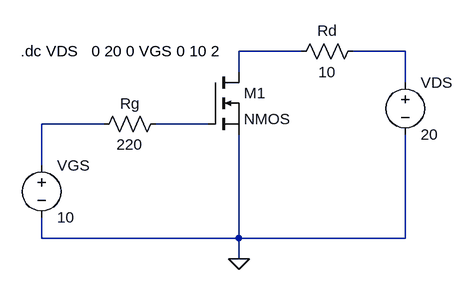
[diagram p0: schematic MOSFET (1).asc]
MOSFET (1).asc, the LTspice schematic file:
Version 4
SHEET 1 880 680
WIRE 368 -16 272 -16
WIRE 528 -16 448 -16
WIRE 272 16 272 -16
WIRE 528 32 528 -16
WIRE 64 96 -32 96
WIRE 224 96 144 96
WIRE -32 160 -32 96
WIRE -32 272 -32 240
WIRE 272 272 272 112
WIRE 272 272 -32 272
WIRE 528 272 528 112
WIRE 528 272 272 272
WIRE 272 304 272 272
FLAG 272 304 0
SYMBOL voltage -32 144 R0
SYMATTR InstName VGS
SYMATTR Value 10
SYMBOL voltage 528 16 R0
SYMATTR InstName VDS
SYMATTR Value 20
SYMBOL res 160 80 R90
WINDOW 0 0 56 VBottom 2
WINDOW 3 32 56 VTop 2
SYMATTR InstName Rg
SYMATTR Value 220
SYMBOL nmos 224 16 R0
SYMATTR InstName M1
SYMBOL res 464 -32 R90
WINDOW 0 0 56 VBottom 2
WINDOW 3 32 56 VTop 2
SYMATTR InstName Rd
SYMATTR Value 10
TEXT -64 -16 Left 2 !.dc VDS   0 20 0 VGS 0 10 2

The netlist it stands for:
* MOSFET (1).asc
VGS N003 0 10
VDS N002 0 20
Rg N004 N003 220
M1 N001 N004 0 0 NMOS
Rd N002 N001 10
.model NMOS NMOS
.model PMOS PMOS
.lib standard.mos
.dc VDS   0 20 0 VGS 0 10 2
.backanno
.end